# Altium schematic sheet DC Circuitry.SchDoc
size A3; SheetNumber: 6; SheetTotal: 6
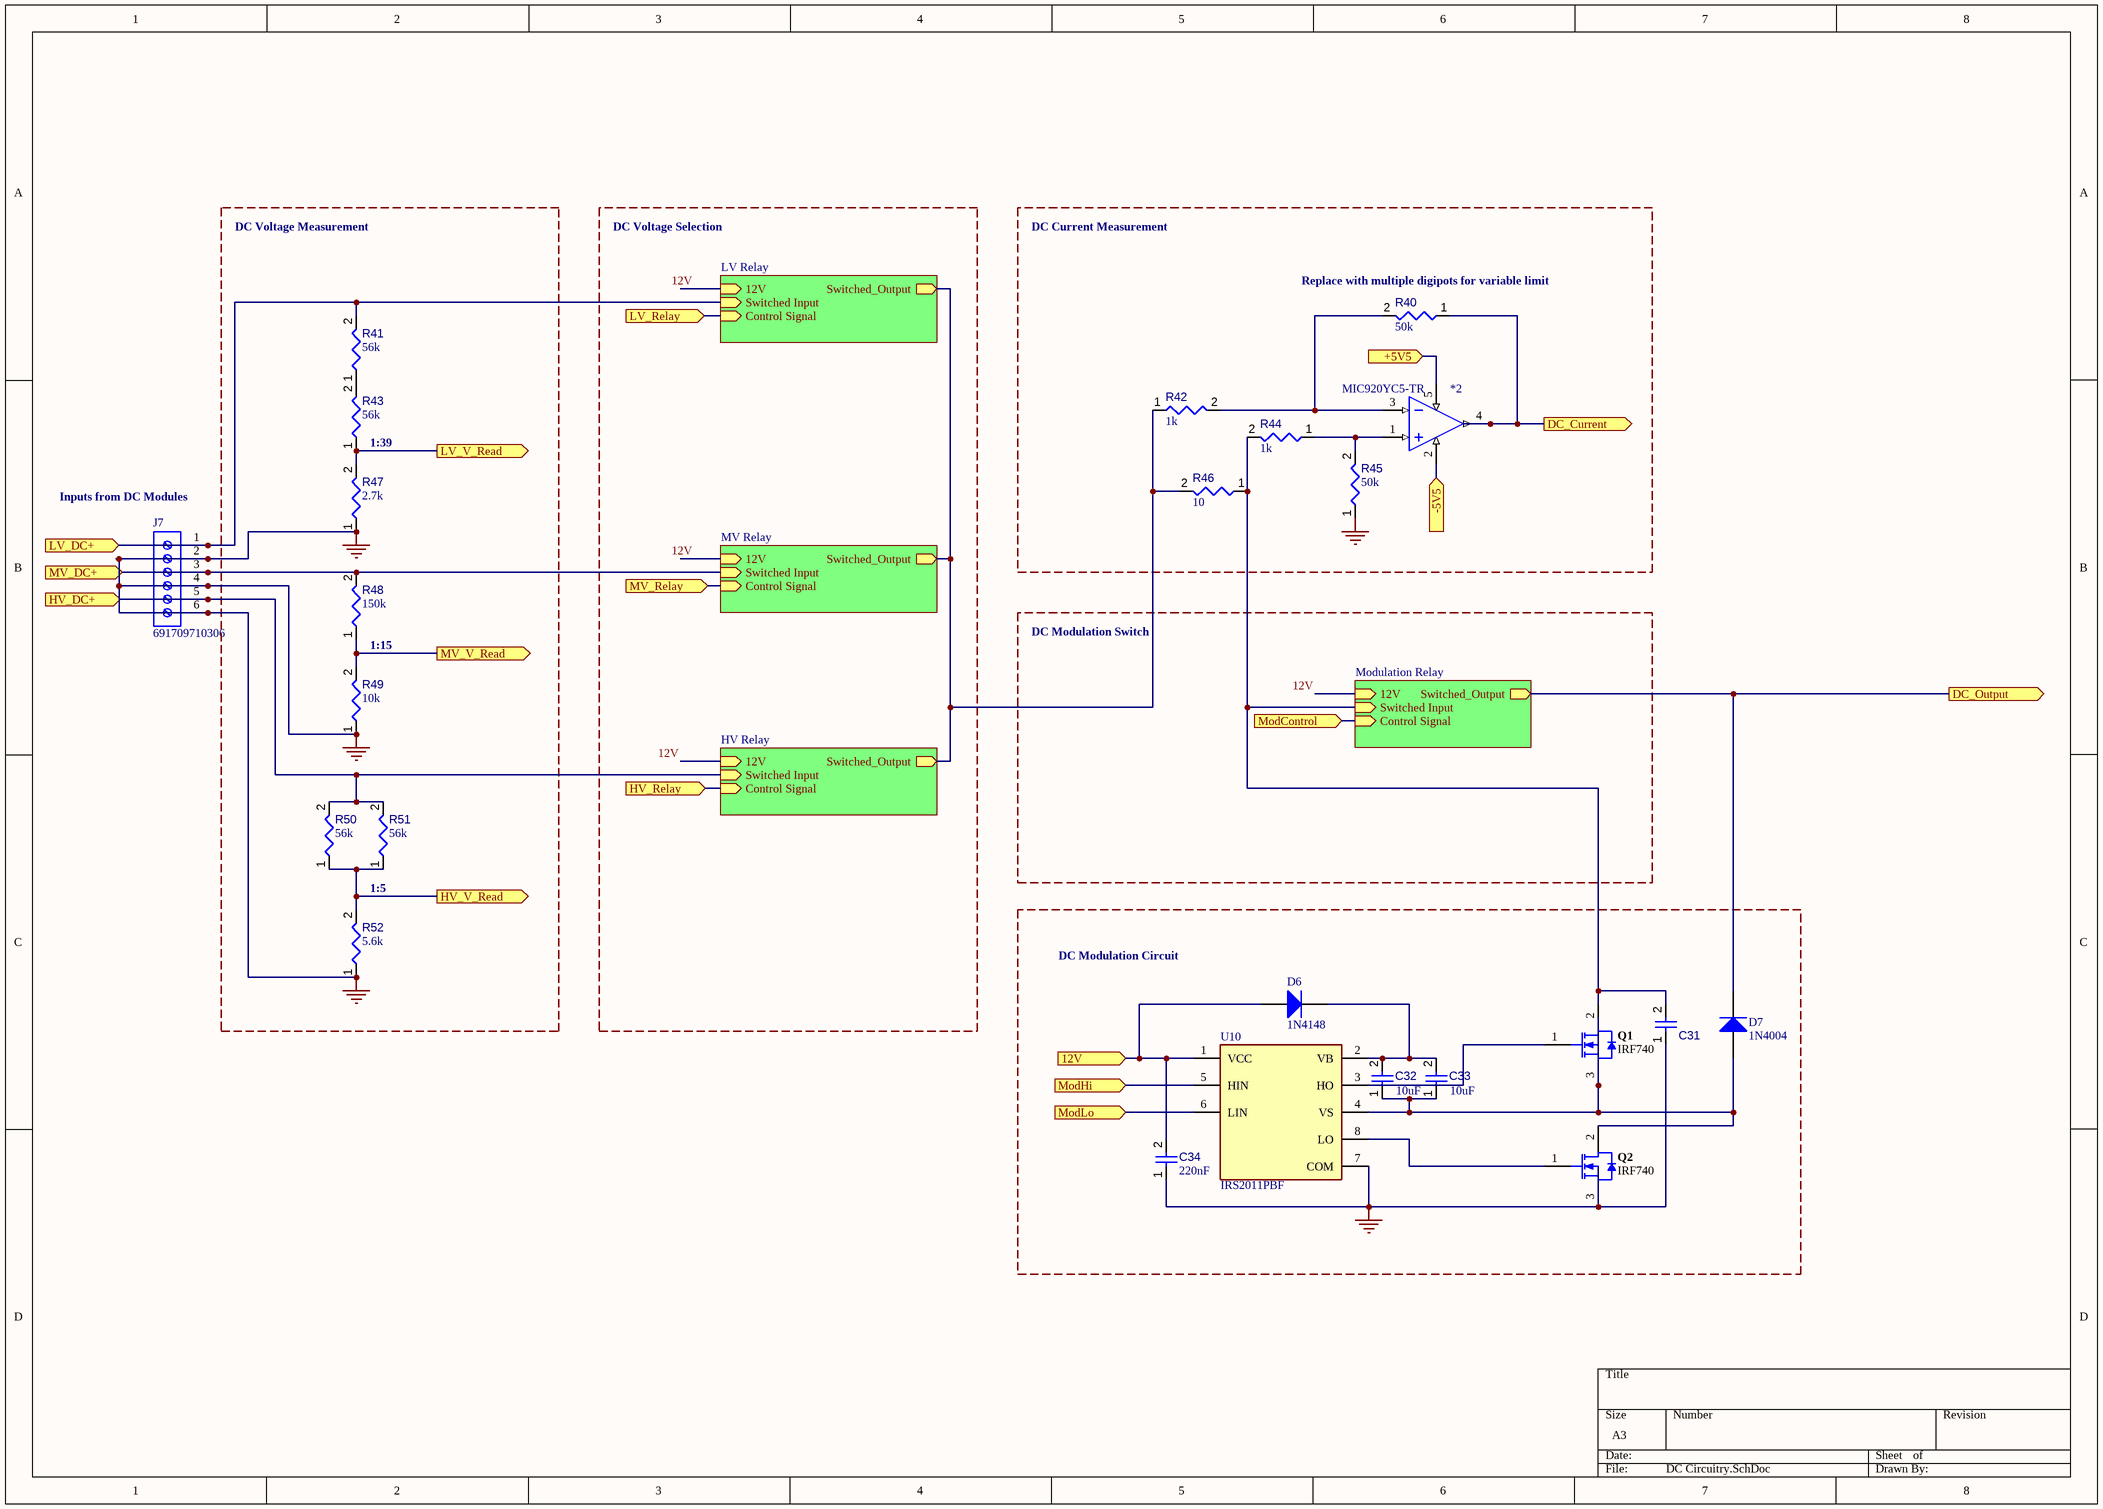
[diagram p0: DC Circuitry.SchDoc]

## Parts
*2  MIC920YC5-TR  [SOT65P129X100-6N]
C31  Capacitors  (value not drawn)
C32  value 10uF  [FP-C3225-250-0_4-IPC_A]  (hidden comment: C3225X7R1H106K250AC)
C33  value 10uF  [FP-C3225-250-0_4-IPC_A]  (hidden comment: C3225X7R1H106K250AC)
C34  value 220nF  [FP-C0603C-CF-IPC_B]  (hidden comment: C0603C224K3RACTU)
D6  1N4148  [NXP-SOD27-2_V]
D7  1N4004  [FAIR-DO-41-2]
J7  691709710306  [691709710306]
Q1  IRF740  [IRF740-Footprint-1]
Q2  IRF740  [IRF740-Footprint-1]
R40  value 50k  [FP-MF0207-MFG]  (hidden comment: MF0207FTE52-10K)
R41  value 56k  [FP-MF0207-MFG]  (hidden comment: MF0207FTE52-10K)
R42  value 1k  [RESA60-630X240]  (hidden comment: MFR-25FBF52-1K)
R43  value 56k  [FP-MF0207-MFG]  (hidden comment: MF0207FTE52-10K)
R44  value 1k  [RESA60-630X240]  (hidden comment: MFR-25FBF52-1K)
R45  value 50k  [FP-MF0207-MFG]  (hidden comment: MF0207FTE52-10K)
R46  value 10  [RESC0402(1005)_L]  (hidden comment: Resistor 10R  +/-1 % 0402 63 mW)
R47  value 2.7k  [FP-MF0207-MFG]  (hidden comment: MF0207FTE52-10K)
R48  value 150k  [FP-MF0207-MFG]  (hidden comment: MF0207FTE52-10K)
R49  value 10k  [FP-MF0207-MFG]  (hidden comment: MF0207FTE52-10K)
R50  value 56k  [FP-MF0207-MFG]  (hidden comment: MF0207FTE52-10K)
R51  value 56k  [FP-MF0207-MFG]  (hidden comment: MF0207FTE52-10K)
R52  value 5.6k  [FP-MF0207-MFG]  (hidden comment: MF0207FTE52-10K)
U10  IRS2011PBF  [FP-PG-DIP-8-MFG]

## Blocks framed on the sheet
DC Modulation Circuit: C31-C34 D6 D7 Q1 Q2 U10

## Sub-sheets
HV Relay = Relay Control.SchDoc: 12V (in), Switched_Output (out), Switched Input (in), Control Signal (in)
LV Relay = Relay Control.SchDoc: 12V (in), Switched_Output (out), Switched Input (in), Control Signal (in)
Modulation Relay = Relay Control.SchDoc: 12V (in), Switched_Output (out), Switched Input (in), Control Signal (in)
MV Relay = Relay Control.SchDoc: 12V (in), Switched_Output (out), Switched Input (in), Control Signal (in)

## Ports
12V (in), +5V5 (in), -5V5 (in), DC_Current (out), DC_Output (out), HV_DC+ (in), HV_Relay (in), HV_V_Read (out), LV_DC+ (in), LV_Relay (in), LV_V_Read (out), ModControl (in), ModHi (in), ModLo (in), MV_DC+ (in), MV_Relay (in), MV_V_Read (out)

## Nets
GND: C31.1 C34.1 J7.2 J7.4 J7.6 Q2.3(S) R45.1 R47.1 R49.1 R52.1 U10.7(COM)
12V: C34.2 D6.1(A) U10.1(VCC) ; port 12V
12V: sheet Modulation Relay/12V, sheet MV Relay/12V, sheet LV Relay/12V, sheet HV Relay/12V  [a separate net that carries the same name]
+5V5: *2.5(V+) ; port +5V5
-5V5: *2.2(V-) ; port -5V5
DC_Current: *2.4(OUT) R40.1 ; port DC_Current
DC_Output: D7.2(K) ; port DC_Output, sheet Modulation Relay/Switched_Output
HV_DC+: J7.5 R50.2 R51.2 ; port HV_DC+, sheet HV Relay/Switched Input
HV_Relay: port HV_Relay, sheet HV Relay/Control Signal
HV_V_Read: R50.1 R51.1 R52.2 ; port HV_V_Read
LV_DC+: J7.1 R41.2 ; port LV_DC+, sheet LV Relay/Switched Input
LV_Relay: port LV_Relay, sheet LV Relay/Control Signal
LV_V_Read: R43.1 R47.2 ; port LV_V_Read
ModControl: port ModControl, sheet Modulation Relay/Control Signal
ModHi: U10.5(HIN) ; port ModHi
ModLo: U10.6(LIN) ; port ModLo
MV_DC+: J7.3 R48.2 ; port MV_DC+, sheet MV Relay/Switched Input
MV_Relay: port MV_Relay, sheet MV Relay/Control Signal
MV_V_Read: R48.1 R49.2 ; port MV_V_Read
Net*2_1: *2.1(+IN) R44.1 R45.2
Net*2_3: *2.3(-IN) R40.2 R42.2
NetC31_2: C31.2 Q1.2(D) R44.2 R46.1 ; sheet Modulation Relay/Switched Input
NetC32_1: C32.1 C33.1 D7.1(A) Q1.3(S) Q2.2(D) U10.4(VS)
NetC32_2: C32.2 C33.2 D6.2(K) U10.2(VB)
NetQ1_1: Q1.1(G) U10.3(HO)
NetQ2_1: Q2.1(G) U10.8(LO)
NetR41_1: R41.1 R43.2
NetR42_1: R42.1 R46.2 ; sheet MV Relay/Switched_Output, sheet LV Relay/Switched_Output, sheet HV Relay/Switched_Output

## Notes on the sheet
- DC Voltage Measurement
- DC Voltage Selection
- DC Current Measurement
- (near R40) Replace with multiple digipots for variable limit
- (near R43) 1:39
- (near J7) Inputs from DC Modules
- 1:15
- DC Modulation Switch
- 1:5

## Library data of the parts
*2 = CMP-014-00002-2: Operational Amplifier, 1 Func, 5000uV Offset-Max, PDSO5; Channels: 1; Nominal Supply Voltage: 5V; Amplifier Type: OPERATIONAL AMPLIFIER; Case/Package: TSSOP; Pins: 5; Min Operating Temperature: -40°C; RoHS Compliant: Yes; Max Operating Temperature: 85°C
C31 = Capacitors: Capacitor; Component Type: Capacitors
C32 C33 = CMP-001-00087-1: Ceramic Capacitor, Multilayer, Ceramic, 50V, 10% +Tol, 10% -Tol, X7R, 15% TC, 10uF, Surface Mount, 1210; RoHS Compliant: Yes
C34 = CMP-001-00093-1: 0603 C 220nF Ceramic Multilayer Capacitor; 25 V; +125degC; X7R Dielec; +/-10%; Voltage Rating: 25V; Tolerance: 10%; Mounting Technology: Surface Mount; Pins: 2; Case/Package: 0603; Max Operating Temperature: 125°C; Min Operating Temperature: -55°C; RoHS Compliant: Yes
D6 = CMP-004-00000-2: High Speed Diode, 100 V, 0.45 A, -65 to 175 degC, 2-Pin SOD27, RoHS, Bulk; Manufacturer: Fairchild; Elements: 1; Recovery Time: 4ns; Forward Current: 300mA; Power: 500mW; Forward Voltage: 1V; Max Surge Current: 4A; Peak Reverse Current: 5uA; Datasheet URL: http://www.nxp.com/documents/data_sheet/1N4148_1N4448.pdf; Min Operating Temperature: -65°C; Manufacturer URL: https://www.fairchildsemi.com/; Packaging: Bulk; Diameter: 1.91mm; Pins: 2; Package URL: http://www.nxp.com/documents/data_sheet/1N4148_1N4448.pdf; Package Reference: SOD27; Max Operating Temperature: 175°C; Package Quantity: 2000; Case/Package: DO; Datasheet Version: Aug-04; RoHS Compliant: True
D7 = CMP-004-00004-2: General Purpose Rectifier, 400 V, 1 A, -55 to 175 degC, 2-Pin DO-204AL (DO-41), RoHS, Tape and Reel; Manufacturer: Fairchild Semiconductor; Forward Voltage: 1.1V; Forward Current: 1A; Max Surge Current: 30A; Package Version: Rev. 2, 09/2008; Peak Reverse Current: 50A; Case/Package: DO-41-2; Pins: 2; RoHS Compliant: True; Diameter: 2.72mm; Package Reference: DO-41-2; Datasheet URL: https://www.fairchildsemi.com/datasheets/1N/1N4004.pdf; Manufacturer URL: https://www.fairchildsemi.com/; Max Operating Temperature: 175°C; Datasheet Version: Rev. 1.1.0, 11/2014; Package URL: http://www.fairchildsemi.com/dwg/DO/DO41A.pdf; Package Quantity: 5000; Min Operating Temperature: -55°C; Package Description: 2-Pin Axial Lead, Dia 2.375 mm, Body Length 4.63 mm; Mounting Technology: TH; Packaging: TapeandReel
J7 = CMP-002-00073-2: WR-TBL Terminal block - Rising Cage - SMT 6 way screw
Q1 Q2 = CMP-013-00034-2: Power Field-Effect Transistor, 10A I(D), 400V, 0.55ohm, 1-Element, N-Channel, Silicon, Metal-oxide Semiconductor FET, TO-220AB; Max Operating Temperature: 150°C; RoHS Compliant: Yes; Pins: 3
R40 R41 R43 R45 R47-R52 = CMP-009-00178-1: Fixed Resistor, Metal Film, 0.6W, 10000ohm, 350V, 1% +/-Tol, 50ppm/Cel, Through Hole Mount; Mounting Technology: Through Hole; Min Operating Temperature: -55°C; Tolerance: 1%; Case/Package: Axial; Max Operating Temperature: 155°C; RoHS Compliant: Yes
R42 R44 = CMP-009-00195-1: Fixed Resistor, Metal Film, 0.25W, 1000ohm, 250V, 1% +/-Tol, 100ppm/Cel, Through Hole Mount; Power: 250mW; Tolerance: 1%; RoHS Compliant: Yes; Min Operating Temperature: -55°C; Max Operating Temperature: 155°C; Mounting Technology: Through Hole; Pins: 2
R46 = CMP-009-00152-3: Chip Resistor, 10 Ohms, +/-1 %, 63 mW, -55 to 155 degC, 0402; Tolerance: 1%; Power: 63mW; Pins: 2; Max Operating Temperature: 155°C; Min Operating Temperature: -55°C; Case/Package: 0402
U10 = CMP-013-00035-1: Buffer/Inverter Based Peripheral Driver, CMOS, PDIP8; Min Operating Temperature: -40°C; RoHS Compliant: Yes; Pins: 8; Max Operating Temperature: 125°C; Case/Package: DIP